# Altium schematic sheet 10-SoC CLOCK AND RESET.SchDoc
size 513 x 386 mm
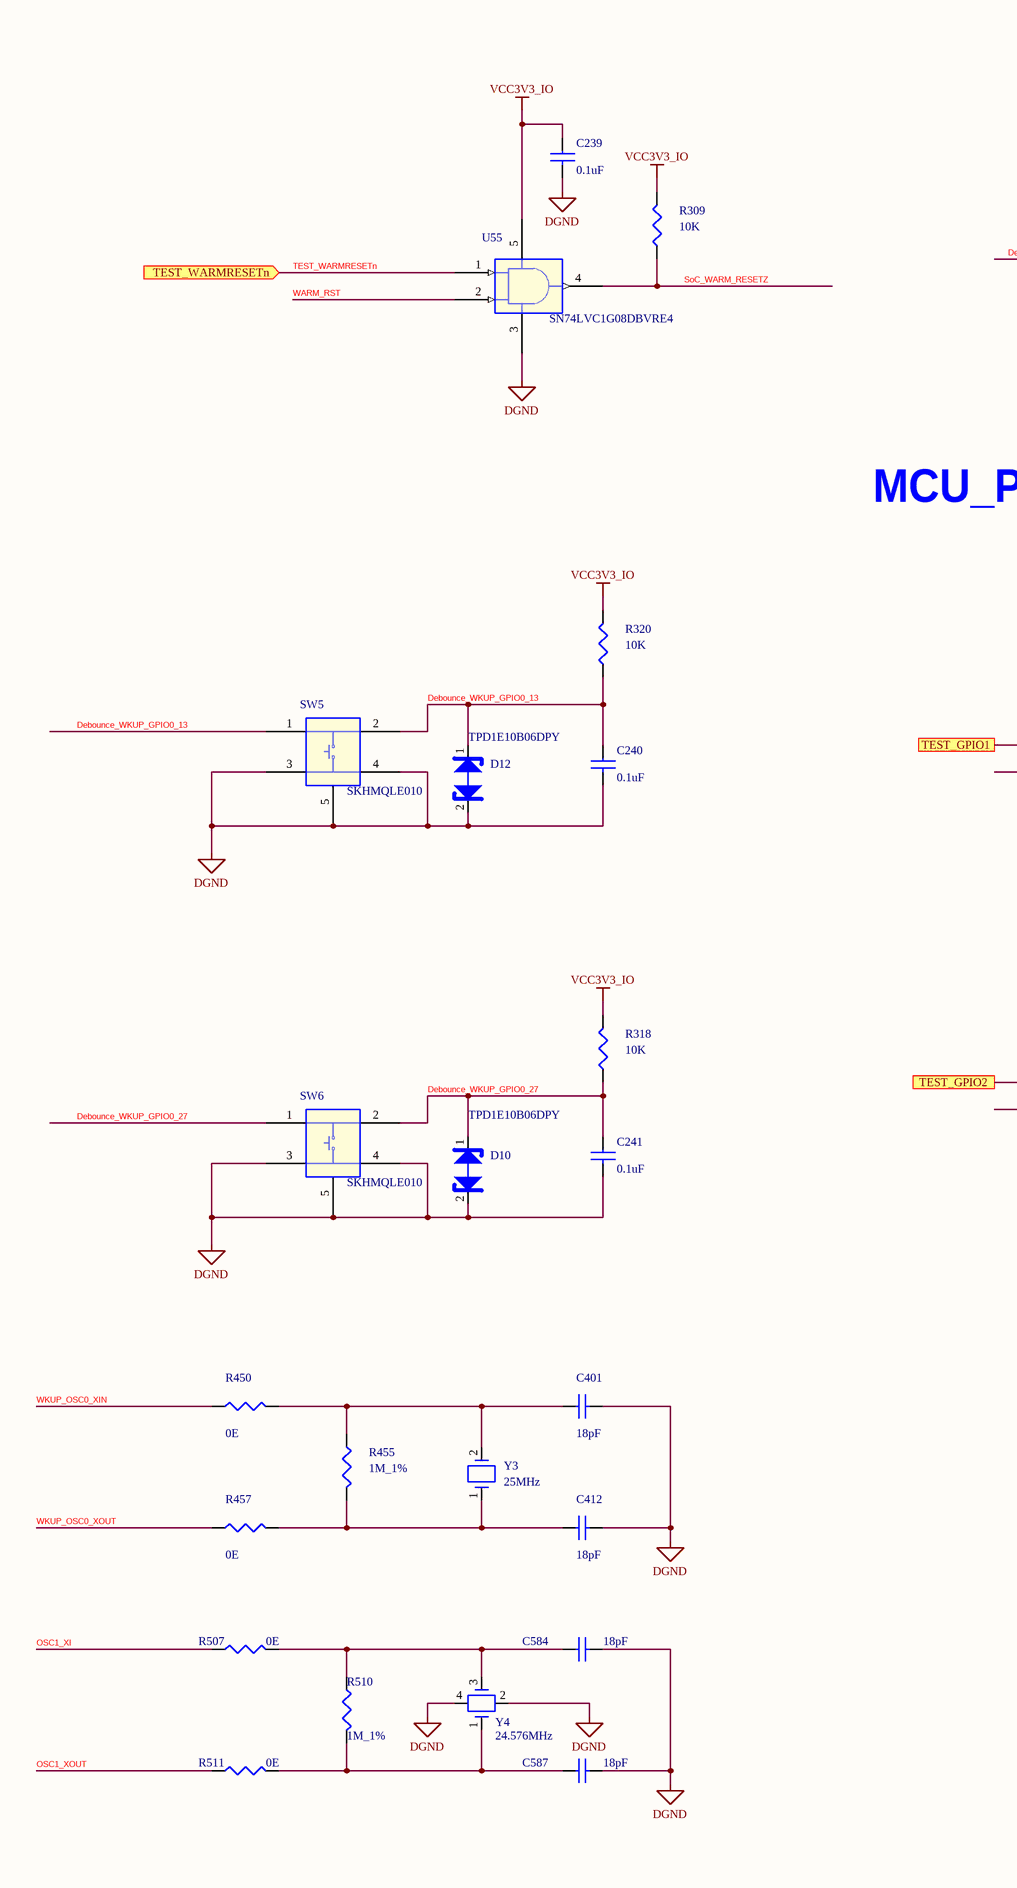
[diagram p0: 10-SoC CLOCK AND RESET.SchDoc, left]
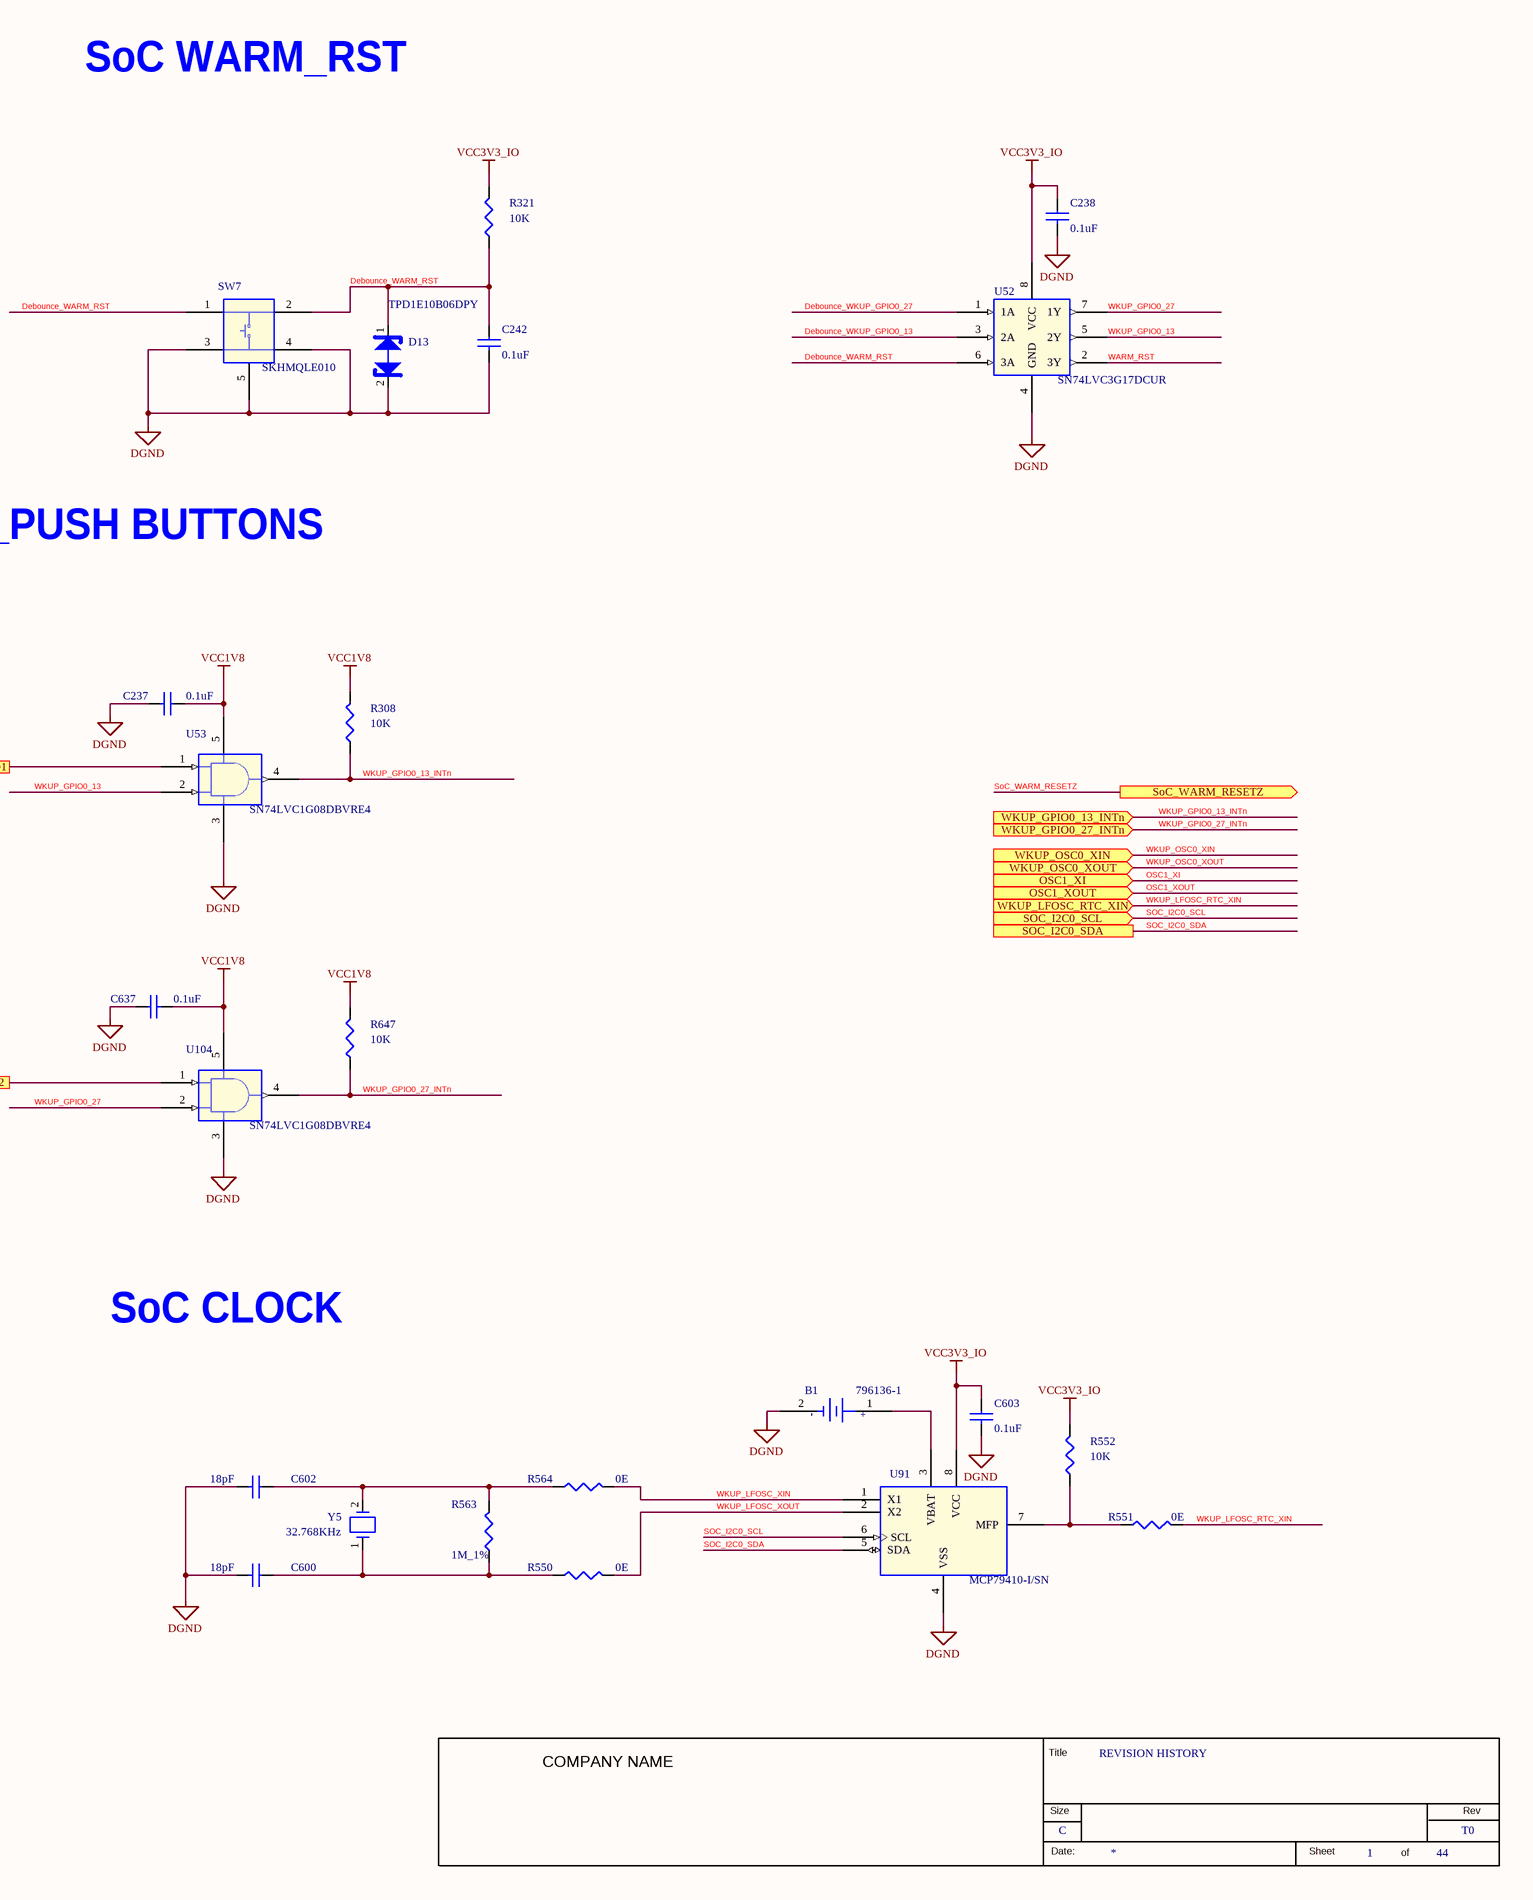
[diagram p1: 10-SoC CLOCK AND RESET.SchDoc, right]

## Parts
*  RevCode: T0  Title: REVISION HISTORY  Page Size: C  Page Number: 1  Page Count: 44  (hidden comment: TRAINING_TITLEBLK_CSIZE)  (graphical)
B1  796136-1  [BATTH2_796136_1080X750_SMD_6-9]
C237  0.1uF  [CAP0201_0-5]
C238  0.1uF  [CAP0201_0-5]
C239  0.1uF  [CAP0201_0-5]
C240  0.1uF  [CAP0201_0-5]
C241  0.1uF  [CAP0201_0-5]
C242  0.1uF  [CAP0201_0-5]
C401  18pF  [CAP0402_0-75]
C412  18pF  [CAP0402_0-75]
C584  18pF  [CAP0402_0-75]
C587  18pF  [CAP0402_0-75]
C600  18pF  [CAP0402_0-75]
C602  18pF  [CAP0402_0-75]
C603  0.1uF  [CAP0201_0-5]
C637  0.1uF  [CAP0201_0-5]
D10  TPD1E10B06DPY  [DIO_DFN0402]
D12  TPD1E10B06DPY  [DIO_DFN0402]
D13  TPD1E10B06DPY  [DIO_DFN0402]
R308  10K  [RES0402_0-5]
R309  10K  [RES0402_0-5]
R318  10K  [RES0402_0-5]
R320  10K  [RES0402_0-5]
R321  10K  [RES0402_0-5]
R450  0E  [RES0402_0-5]
R455  1M_1%  [RES0402]
R457  0E  [RES0402_0-5]
R507  0E  [RES0402_0-5]
R510  1M_1%  [RES0402]
R511  0E  [RES0402_0-5]
R550  0E  [RES0402_0-5]
R551  0E  [RES0402_0-5]
R552  10K  [RES0402_0-5]
R563  1M_1%  [RES0402]
R564  0E  [RES0402_0-5]
R647  10K  [RES0402_0-5]
SW5  SKHMQLE010  [SW4_SKHMQLE010_240X260_SMD_3-1]
SW6  SKHMQLE010  [SW4_SKHMQLE010_240X260_SMD_3-1]
SW7  SKHMQLE010  [SW4_SKHMQLE010_240X260_SMD_3-1]
U52  SN74LVC3G17DCUR  [VSSOP8_19-68_85X95_0-9]
U53  SN74LVC1G08DBVRE4  [SOT23-5]
U55  SN74LVC1G08DBVRE4  [SOT23-5]
U91  MCP79410-I/SN  [SOIC8_1-8]
U104  SN74LVC1G08DBVRE4  [SOT23-5]
Y3  25MHz  [XTAL_ABM3_210X130_SMD]
Y4  24.576MHz  [XTAL4_TXC_130X100_SMD_0-8]
Y5  32.768KHz  [XTAL_ABS07_130X60_SMD_0-9]

## Ports
OSC1_XI (in), OSC1_XOUT (in), SOC_I2C0_SCL (in), SOC_I2C0_SDA, SoC_WARM_RESETZ (out), TEST_GPIO1, TEST_GPIO2, TEST_WARMRESETn (in), WKUP_GPIO0_13_INTn (in), WKUP_GPIO0_27_INTn (in), WKUP_LFOSC_RTC_XIN (in), WKUP_OSC0_XIN (in), WKUP_OSC0_XOUT (in)

## Nets
DGND: B1.2(-) C237.2 C238.2 C239.2 C240.2 C241.2 C242.2 C401.2 C412.2 C584.2 C587.2 C600.2 C602.2 C603.2 C637.1 D10.2(A) D12.2(A) D13.2(A) SW5.3 SW5.4 SW5.5(GND) SW6.3 SW6.4 SW6.5(GND) SW7.3 SW7.4 SW7.5(GND) U52.4(GND) U53.3(GND) U55.3(GND) U91.4(VSS) U104.3(GND) Y4.2 Y4.4
VCC1V8: C237.1 C637.2 R308.2 R647.2 U53.5(VCC) U104.5(VCC)
VCC3V3_IO: C238.1 C239.1 C603.1 R309.2 R318.2 R320.2 R321.2 R552.2 U52.8(VCC) U55.5(VCC) U91.8(VCC)
Debounce_WARM_RST: C242.1 D13.1(K) R321.1 SW7.1 SW7.2 U52.6(3A)
Debounce_WKUP_GPIO0_13: C240.1 D12.1(K) R320.1 SW5.1 SW5.2 U52.3(2A)
Debounce_WKUP_GPIO0_27: C241.1 D10.1(K) R318.1 SW6.1 SW6.2 U52.1(1A)
OSC1_XI: R507.1 ; port OSC1_XI
OSC1_XOUT: R511.1 ; port OSC1_XOUT
SOC_I2C0_SCL: U91.6(SCL) ; port SOC_I2C0_SCL
SOC_I2C0_SDA: U91.5(SDA) ; port SOC_I2C0_SDA
SoC_WARM_RESETZ: R309.1 U55.4(Y) ; port SoC_WARM_RESETZ
TEST_GPIO1: U53.1(A) ; port TEST_GPIO1
TEST_GPIO2: U104.1(A) ; port TEST_GPIO2
TEST_WARMRESETn: U55.1(A) ; port TEST_WARMRESETn
WARM_RST: U52.2(3Y) U55.2(B)
WKUP_GPIO0_13: U52.5(2Y) U53.2(B)
WKUP_GPIO0_13_INTn: R308.1 U53.4(Y) ; port WKUP_GPIO0_13_INTn
WKUP_GPIO0_27: U52.7(1Y) U104.2(B)
WKUP_GPIO0_27_INTn: R647.1 U104.4(Y) ; port WKUP_GPIO0_27_INTn
WKUP_LFOSC_RTC_XIN: R551.2 ; port WKUP_LFOSC_RTC_XIN
WKUP_LFOSC_XIN: R564.1 U91.1(X1)
WKUP_LFOSC_XOUT: R550.1 U91.2(X2)
WKUP_OSC0_XIN: R450.1 ; port WKUP_OSC0_XIN
WKUP_OSC0_XOUT: R457.1 ; port WKUP_OSC0_XOUT
NetB1_1: B1.1(+) U91.3(VBAT)
NetC401_1: C401.1 R450.2 R455.1 Y3.2
NetC412_1: C412.1 R455.2 R457.2 Y3.1
NetC584_1: C584.1 R507.2 R510.1 Y4.3
NetC587_1: C587.1 R510.2 R511.2 Y4.1
NetC600_1: C600.1 R550.2 R563.2 Y5.1
NetC602_1: C602.1 R563.1 R564.2 Y5.2
NetR551_1: R551.1 R552.1 U91.7(MFP)

## Notes on the sheet
- SoC WARM_RST
- MCU_PUSH BUTTONS
- SoC CLOCK
- (in symbol TRAINING_TITLEBLK_CSIZE) Title; COMPANY NAME; Size; Rev; Date:; Sheet; of

## Library data of the parts
* = TRAINING_TITLEBLK_CSIZE: Issue: 1.0; Page Create Date: Jan  8, 2022; Page Modify Date: *
B1 = BATTERY: BATTERY HOLDER COIN CELL TOP LOAD SMD; Mfr_name: AMP INCORPORATED; Mistral Part No: 130011020020-R; Wattage: NA; Project: OMAPL1_PEC20; Library Ref: BATTERY; Chkd/date: MANIRAJA/161017; Crtd /date: BAVISH/090211; Datasheet: Y:\MIS_DATABASE\DATASHEETS\MISC\BATTERY\796136-1.PDF; Temperature: NA; Weight: NA; Height: 6.85MM; Distributor_part_number: A99327CT-ND; Distributor_name: DIGIKEY; Package: SMD; Voltage: NA; Tolerance: NA; Part_type: BATTERY HOLDER; Mfr_part_number: 796136-1; MECHANICAL 3D STEP FILE: BATTH2_796136_1080X750_SMD_6-9; PCB Footprint: BATTH2_796136_1080X750_SMD_6-9
C237-C239 C242 = CAP_Dup5: CAP CERAMIC 0.1uF 16V 10% X5R 0201; Part_type: CAPACITORS\CERAMIC; Mfr_part_number: GRM033R61C104KE84J; Mfr_name: MURATA; Mistral Part No: 120009030072-R; Custom_Duty: 15%; Customs_HS_Code: 85322990; Wattage: NA; Project: TI_MAXIE_CPB; Library Ref: CAP; MECHANICAL 3D STEP FILE: CAP0201_0-5; Chkd/date: MANIRAJA/120218; Crtd /date: MANIRAJA/120218; Datasheet: Y:\MIS_DATABASE\DATASHEETS\CAPACITORS\GRM033R61C104KE84.PDF; Temperature: -55°C+85°C; Weight: 0.33mg; Height: 0.33MM; Distributor_part_number: 490-16742-1-ND; Distributor_name: DIGIKEY; Package: 0201; Voltage: 16V; Tolerance: 10%; PCB Footprint: CAP0201_0-5
C240 C241 C603 C637 = CAP_Dup5: CAP CERAMIC 0.1uF 16V 10% X5R 0201; Mistral Part No: 120009030072-R; Mfr_name: MURATA; Mfr_part_number: GRM033R61C104KE84J; Part_type: CAPACITORS\CERAMIC; Project: TI_MAXIE_CPB; Wattage: NA; Customs_HS_Code: 85322990; Custom_Duty: 15%; Library Ref: CAP; Tolerance: 10%; Voltage: 16V; Package: 0201; Distributor_name: DIGIKEY; Distributor_part_number: 490-16742-1-ND; Height: 0.33MM; Weight: 0.33mg; Temperature: -55°C+85°C; Datasheet: Y:\MIS_DATABASE\DATASHEETS\CAPACITORS\GRM033R61C104KE84.PDF; Crtd /date: MANIRAJA/120218; Chkd/date: MANIRAJA/120218; MECHANICAL 3D STEP FILE: CAP0201_0-5; PCB Footprint: CAP0201_0-5
C401 C412 C584 C587 C602 = CAP_Dup5: CAP CERAMIC 18pF 50V 5% C0G(NP0) 0402; Part_type: CAPACITORS\CERAMIC; Mfr_part_number: GRM1555C1H180JA01D; Mfr_name: MURATA; Mistral Part No: 120014050002-R; Custom_Duty: 15%; Customs_HS_Code: 85322990; Wattage: NA; Project: HUMANWARE_PHOENIX; Footprint Path: Y:\MIS_DATABASE\Library\ALTIUM_TOOL\PCB_FOOTPRINTS\Altium_Footprint_Lib.PcbLib; Library Path: Y:\MIS_DATABASE\Library\ALTIUM_TOOL\SCHEMATICS_PARTS\MS_DISCRETE_Library.schlib; MECHANICAL 3D STEP FILE: CAP0402_0-75; PCB Footprint: CAP0402_0-75; Footprint Ref: CAP0402_0-75; Library Ref: CAP; Chkd/date: VASANTHA/150514; Crtd /date: BALACHANDAR/150514; Datasheet: Y:\MIS_DATABASE\DATASHEETS\CAPACITORS\GRM188SERIES.PDF; Temperature: -55°C+125°C; Weight: 6mg; Height: 0.55MM; Distributor_part_number: 490-5858-1-ND; Distributor_name: DIGIKEY; Package: 0402; Voltage: 50V; Tolerance: 5%
C600 = CAP_Dup5: CAP CERAMIC 18pF 50V 5% C0G(NP0) 0402; Mistral Part No: 120014050002-R; Mfr_name: MURATA; Mfr_part_number: GRM1555C1H180JA01D; Part_type: CAPACITORS\CERAMIC; Project: HUMANWARE_PHOENIX; Wattage: NA; Customs_HS_Code: 85322990; Custom_Duty: 15%; Footprint Path: Y:\MIS_DATABASE\Library\ALTIUM_TOOL\PCB_FOOTPRINTS\Altium_Footprint_Lib.PcbLib; Library Path: Y:\MIS_DATABASE\Library\ALTIUM_TOOL\SCHEMATICS_PARTS\MS_DISCRETE_Library.schlib; MECHANICAL 3D STEP FILE: CAP0402_0-75; PCB Footprint: CAP0402_0-75; Footprint Ref: CAP0402_0-75; Library Ref: CAP; Tolerance: 5%; Voltage: 50V; Package: 0402; Distributor_name: DIGIKEY; Distributor_part_number: 490-5858-1-ND; Height: 0.55MM; Weight: 6mg; Temperature: -55°C+125°C; Datasheet: Y:\MIS_DATABASE\DATASHEETS\CAPACITORS\GRM188SERIES.PDF; Crtd /date: BALACHANDAR/150514; Chkd/date: VASANTHA/150514
D10 D12 = DIODE_PESD: DIODE 1CH ESD PROTECTION SMD(0402); Mistral Part No: 130014110022-R; Mfr_name: TEXAS INSTRUMENTS; Part_type: DIODE\MISC; Project: GALILEO_EVM; Tolerance: NA; Customs_HS_Code: 85423100; Custom_Duty: 15%; Library Ref: DIODE_PESD; Mfr_part_number: TPD1E10B06DPY; Voltage: NA; Wattage: NA; Package: SMD; Distributor_name: DIGIKEY; Distributor_part_number: 296-30406-1-ND; Height: 0.45MM; Weight: NA; Temperature: -40°C+125°C; Datasheet: Y:\MIS_DATABASE\DATASHEETS\ICS\INTERFACE\TPD1E10B06.PDF; Crtd /date: VASANTHA/181114; Chkd/date: USMAN/021214; PCB Footprint: DIO_DFN0402
D13 = DIODE_PESD: DIODE 1CH ESD PROTECTION SMD(0402); Part_type: DIODE\MISC; Mfr_name: TEXAS INSTRUMENTS; Mistral Part No: 130014110022-R; Custom_Duty: 15%; Customs_HS_Code: 85423100; Wattage: NA; Project: GALILEO_EVM; Library Ref: DIODE_PESD; Chkd/date: USMAN/021214; Crtd /date: VASANTHA/181114; Datasheet: Y:\MIS_DATABASE\DATASHEETS\ICS\INTERFACE\TPD1E10B06.PDF; Temperature: -40°C+125°C; Weight: NA; Height: 0.45MM; Distributor_part_number: 296-30406-1-ND; Distributor_name: DIGIKEY; Package: SMD; Voltage: NA; Tolerance: NA; Mfr_part_number: TPD1E10B06DPY; PCB Footprint: DIO_DFN0402
R308 R647 = RESISTOR_Dup5: RES 10K 1/16W 5% 0402; Mistral Part No: 110009030208-R; Mfr_name: YAGEO AMERICA; Mfr_part_number: RC0402JR-0710KL; Part_type: RESISTORS\FIXED; Project: HSE; Voltage: NA; Customs_HS_Code: 85332119; Custom_Duty: 15%; Footprint Path: Y:\MIS_DATABASE\Library\ALTIUM_TOOL\PCB_FOOTPRINTS\Altium_Footprint_Lib.PcbLib; Library Path: Y:\MIS_DATABASE\Library\ALTIUM_TOOL\SCHEMATICS_PARTS\MS_DISCRETE_Library.schlib; Footprint Ref: RES0402_0-5; Library Ref: RESISTOR; Tolerance: 5%; Wattage: 1/16W; Package: 0402; Distributor_name: DIGIKEY; Distributor_part_number: 311-10KJRCT-ND; Height: 0.40MM; Weight: 0.65mg; Temperature: -55°C+155°C; Datasheet: Y:\MIS_DATABASE\DATASHEETS\RESISTORS\YAGEO-RC0402.PDF; Crtd /date: MAZHAR/230805; Chkd/date: VASANTHA/061216; RoHS: Pb-Free; MECHANICAL 3D STEP FILE: RES0402_0-5; PCB Footprint: RES0402_0-5
R309 R318 R320 R321 R552 = RESISTOR_Dup5: RES 10K 1/16W 5% 0402; Part_type: RESISTORS\FIXED; Mfr_part_number: RC0402JR-0710KL; Mfr_name: YAGEO AMERICA; Mistral Part No: 110009030208-R; Custom_Duty: 15%; Customs_HS_Code: 85332119; Voltage: NA; Project: HSE; Footprint Path: Y:\MIS_DATABASE\Library\ALTIUM_TOOL\PCB_FOOTPRINTS\Altium_Footprint_Lib.PcbLib; Library Path: Y:\MIS_DATABASE\Library\ALTIUM_TOOL\SCHEMATICS_PARTS\MS_DISCRETE_Library.schlib; Footprint Ref: RES0402_0-5; Library Ref: RESISTOR; MECHANICAL 3D STEP FILE: RES0402_0-5; RoHS: Pb-Free; Chkd/date: VASANTHA/061216; Crtd /date: MAZHAR/230805; Datasheet: Y:\MIS_DATABASE\DATASHEETS\RESISTORS\YAGEO-RC0402.PDF; Temperature: -55°C+155°C; Weight: 0.65mg; Height: 0.40MM; Distributor_part_number: 311-10KJRCT-ND; Distributor_name: DIGIKEY; Package: 0402; Wattage: 1/16W; Tolerance: 5%; PCB Footprint: RES0402_0-5
R450 R457 R507 R511 R564 = RESISTOR_Dup4: RES 0E 1/16W 0402; Part_type: RESISTORS\FIXED; Mfr_part_number: CRCW04020000Z0ED; Mfr_name: VISHAY; Mistral Part No: 110010080019-P; Custom_Duty: 15%; Customs_HS_Code: 85332119; Voltage: NA; Project: PB_BUGBASE; Footprint Path: Y:\MIS_DATABASE\Library\ALTIUM_TOOL\PCB_FOOTPRINTS\Altium_Footprint_Lib.PcbLib; Library Path: Y:\MIS_DATABASE\Library\ALTIUM_TOOL\SCHEMATICS_PARTS\MS_DISCRETE_Library.schlib; Footprint Ref: RES0402_0-5; Library Ref: RESISTOR; RoHS: Pb-Free; Chkd/date: VASANTHA/201216; Crtd /date: MUDDU/190810; Datasheet: Y:\MIS_DATABASE\DATASHEETS\RESISTORS\CRCW0603.PDF; Temperature: -55°C+155°C; Weight: 0.65g/1000pcs; Height: 0.40MM; Distributor_part_number: 541-0.0JCT-ND; Distributor_name: DIGIKEY; Package: 0402; Wattage: 1/16W; Tolerance: NA; MECHANICAL 3D STEP FILE: RES0402_0-5; PCB Footprint: RES0402_0-5
R455 = RESISTOR_Dup5: RES 1M 1/16W 1% 0402; Part_type: RESISTORS\FIXED; Mfr_part_number: RMCF0402FT1M00; Mfr_name: STACKPOLE ELECTRONICS; Mistral Part No: 110014060045-R; Custom_Duty: 15%; Customs_HS_Code: 85332119; Voltage: NA; Project: AEGIS_POM; NI_MARK: DNI; Footprint Path: Y:\MIS_DATABASE\Library\ALTIUM_TOOL\PCB_FOOTPRINTS\Altium_Footprint_Lib.PcbLib; Library Path: Y:\MIS_DATABASE\Library\ALTIUM_TOOL\SCHEMATICS_PARTS\MS_DISCRETE_Library.schlib; Footprint Ref: RES0402; Library Ref: RESISTOR; Chkd/date: VASANTHA/200614; Crtd /date: NAVEED/170614; Datasheet: Y:\MIS_DATABASE\DATASHEETS\RESISTORS\RMCF-SERIES1.PDF; Temperature: -55°C+155°C; Weight: 0.57mg; Height: 0.40MM; Distributor_part_number: RMCF0402FT1M00CT-ND; Distributor_name: DIGIKEY; Package: 0402; Wattage: 1/16W; Tolerance: 1%; PCB Footprint: RES0402
R510 R563 = RESISTOR_Dup5: RES 1M 1/16W 1% 0402; Mistral Part No: 110014060045-R; Mfr_name: STACKPOLE ELECTRONICS; Mfr_part_number: RMCF0402FT1M00; Part_type: RESISTORS\FIXED; Project: AEGIS_POM; Voltage: NA; Customs_HS_Code: 85332119; Custom_Duty: 15%; NI_MARK: DNI; Footprint Path: Y:\MIS_DATABASE\Library\ALTIUM_TOOL\PCB_FOOTPRINTS\Altium_Footprint_Lib.PcbLib; Library Path: Y:\MIS_DATABASE\Library\ALTIUM_TOOL\SCHEMATICS_PARTS\MS_DISCRETE_Library.schlib; Footprint Ref: RES0402; Library Ref: RESISTOR; Tolerance: 1%; Wattage: 1/16W; Package: 0402; Distributor_name: DIGIKEY; Distributor_part_number: RMCF0402FT1M00CT-ND; Height: 0.40MM; Weight: 0.57mg; Temperature: -55°C+155°C; Datasheet: Y:\MIS_DATABASE\DATASHEETS\RESISTORS\RMCF-SERIES1.PDF; Crtd /date: NAVEED/170614; Chkd/date: VASANTHA/200614; PCB Footprint: RES0402
R550 R551 = RESISTOR_Dup4: RES 0E 1/16W 0402; Mistral Part No: 110010080019-P; Mfr_name: VISHAY; Mfr_part_number: CRCW04020000Z0ED; Part_type: RESISTORS\FIXED; Project: PB_BUGBASE; Tolerance: NA; Customs_HS_Code: 85332119; Custom_Duty: 15%; Footprint Path: Y:\MIS_DATABASE\Library\ALTIUM_TOOL\PCB_FOOTPRINTS\Altium_Footprint_Lib.PcbLib; Library Path: Y:\MIS_DATABASE\Library\ALTIUM_TOOL\SCHEMATICS_PARTS\MS_DISCRETE_Library.schlib; Footprint Ref: RES0402_0-5; Library Ref: RESISTOR; PCB Footprint: RES0402_0-5; MECHANICAL 3D STEP FILE: RES0402_0-5; Voltage: NA; Wattage: 1/16W; Package: 0402; Distributor_name: DIGIKEY; Distributor_part_number: 541-0.0JCT-ND; Height: 0.40MM; Weight: 0.65g/1000pcs; Temperature: -55°C+155°C; Datasheet: Y:\MIS_DATABASE\DATASHEETS\RESISTORS\CRCW0603.PDF; Crtd /date: MUDDU/190810; Chkd/date: VASANTHA/201216; RoHS: Pb-Free
SW5 SW7 = SW4_SKHUPLE010: SWITCH TACTILE SPST ST SMD; Part_type: ELECTRO-MECHANICAL\SWITCH; Mfr_name: ALPS; Mistral Part No: 130017100007-R; Custom_Duty: 24%; Customs_HS_Code: 85369090; Wattage: NA; Project: TI_MAXIE_CPB; Library Ref: SW4_SKHUPLE010; MECHANICAL 3D STEP FILE: SW4_SKHMQLE010_240X260_SMD_3-1; Chkd/date: MANIRAJA/051017; Crtd /date: MANIRAJA/051017; Datasheet: Y:\MIS_DATABASE\DATASHEETS\MISC\SWITCHES\SKHMQLE010.PDF; Temperature: -30°C+85°C; Weight: NA; Height: 3.10MM; Distributor_part_number: 688-SKHMQLE010; Distributor_name: MOUSER; Package: SMD; Voltage: NA; Tolerance: NA; Mfr_part_number: SKHMQLE010; PCB Footprint: SW4_SKHMQLE010_240X260_SMD_3-1
SW6 = SW4_SKHUPLE010: SWITCH TACTILE SPST ST SMD; Mistral Part No: 130017100007-R; Mfr_name: ALPS; Part_type: ELECTRO-MECHANICAL\SWITCH; Project: TI_MAXIE_CPB; Tolerance: NA; Customs_HS_Code: 85369090; Custom_Duty: 24%; Library Ref: SW4_SKHUPLE010; Mfr_part_number: SKHMQLE010; Voltage: NA; Wattage: NA; Package: SMD; Distributor_name: MOUSER; Distributor_part_number: 688-SKHMQLE010; Height: 3.10MM; Weight: NA; Temperature: -30°C+85°C; Datasheet: Y:\MIS_DATABASE\DATASHEETS\MISC\SWITCHES\SKHMQLE010.PDF; Crtd /date: MANIRAJA/051017; Chkd/date: MANIRAJA/051017; MECHANICAL 3D STEP FILE: SW4_SKHMQLE010_240X260_SMD_3-1; PCB Footprint: SW4_SKHMQLE010_240X260_SMD_3-1
U52 = SN74LVC3G17DCUR_VSSOP8: IC TRIPLE SCHMITT-TRIGGER BUFFER VSSOP8; Mistral Part No: 141017090019-R; Mfr_name: TEXAS INSTRUMENTS; Part_type: ICS\DIGITAL\COMBINATIONAL; Project: TI_MAXIE_CPB; Tolerance: NA; Customs_HS_Code: 85423100; Custom_Duty: 15%; Library Ref: SN74LVC3G17DCUR_VSSOP8; Mfr_part_number: SN74LVC3G17DCUR; Voltage: NA; Wattage: NA; Package: VSSOP8; Distributor_name: DIGIKEY; Distributor_part_number: 296-18818-1-ND; Height: 0.90MM; Weight: 9.6mg; Temperature: -40°C+125°C; Datasheet: Y:\MIS_DATABASE\DATASHEETS\ICS\DIGITAL\COMBINATIONAL\SN74LVC3G17.PDF; Crtd /date: MANIRAJA/280917; Chkd/date: MANIRAJA/280917; MECHANICAL 3D STEP FILE: VSSOP8_19-68_85X95_0-9; PCB Footprint: VSSOP8_19-68_85X95_0-9
U53 U55 U104 = SN74LVC1G08DBVRE4_SOT23-5: IC SINGLE 2-INPUT POSITIVE AND GATE SOT23-5; Part_type: ICS\DIGITAL\GATES; Mfr_name: TEXAS INSTRUMENTS; Mistral Part No: 141009060026-R; Custom_Duty: 15%; Customs_HS_Code: 85423100; Project: KHAN_MAIN; Library Ref: SN74LVC1G08DBVRE4_SOT23-5; RoHS: Sb/ Br FREE; Chkd/date: SUHAS/221010; Crtd /date: USMAN/151008; Datasheet: Y:\MIS_DATABASE\DATASHEETS\ICS\DIGITAL\GATES\SN74LVC1G08.PDF; Temperature: -40°C+85°C; Height: 1.45MM; Distributor_part_number: SN74LVC1G08DBVRE4-ND; Distributor_name: DIGIKEY; Package: SOT23-5; Mfr_part_number: SN74LVC1G08DBVRE4; PCB Footprint: SOT23-5
U91 = MCP79410_SOIC8: IC BATTERY-BACKED I2C RTCC WITH SRAM,EEPROM SOIC8; Part_type: ICS\POWER\BATTERY MANGEMENT; Mfr_name: MICROCHIP; Mistral Part No: 142017060006-R; Custom_Duty: 15%; Customs_HS_Code: 85423100; Wattage: NA; Project: TI_SVB_CONTROLLER CARD; Library Ref: MCP79410_SOIC8; MECHANICAL 3D STEP FILE: SOIC8_1-8; Chkd/date: MANIRAJA/190617; Crtd /date: MANIRAJA/190617; Datasheet: Y:\MIS_DATABASE\DATASHEETS\ICS\POWER\MCP7941XX.PDF; Temperature: -40°C+85°C; Weight: 540mg; Height: 1.75MM; Distributor_part_number: MCP79410-I/SN-ND; Distributor_name: DIGIKEY; Package: SOIC8; Voltage: NA; Tolerance: NA; Mfr_part_number: MCP79410-I/SN; PCB Footprint: SOIC8_1-8
Y3 = CRY: CRY 25MHz SMD; Mistral Part No: 130011100003-R; Mfr_name: CTS; Mfr_part_number: 445I23D25M00000; Part_type: CRYSTAL; Project: VP-4000-PROCESSOR; Tolerance: NA; Customs_HS_Code: 85439000; Custom_Duty: 24%; Library Ref: CRY; Voltage: NA; Wattage: NA; Package: SMD; Distributor_name: DIGIKEY; Distributor_part_number: 535-10645-1-ND; Height: 1.50MM; Weight: NA; Temperature: -40°C+85°C; Datasheet: Y:\MIS_DATABASE\DATASHEETS\MISC\CRY_OSC\ABM3.PDF; Crtd /date: CHAITHANYA/041011; Chkd/date: BAVISH/041011; PCB Footprint: XTAL_ABM3_210X130_SMD
Y4 = CRY4_13: CRY 24.576MHz 18pF SMD; Mistral Part No: 130018010021-R; Mfr_name: TXC CORPORATION; Mfr_part_number: 7M-24.576MAAJ-T; Part_type: CRYSTAL; Project: TI_MAXIE_CPB; Tolerance: NA; Customs_HS_Code: 85439000; Custom_Duty: 24%; Library Ref: CRY4_13; PCB Footprint: XTAL4_TXC_130X100_SMD_0-8; Voltage: NA; Wattage: NA; Package: SMD; Distributor_name: DIGIKEY; Distributor_part_number: 887-2373-1-ND; Height: 0.80MM; Weight: 16mg; Temperature: -20°C+70°C; Datasheet: Y:\MIS_DATABASE\DATASHEETS\MISC\CRY_OSC\7M-SER.PDF; Crtd /date: MANIRAJA/240118; Chkd/date: MANIRAJA/240118; MECHANICAL 3D STEP FILE: XTAL4_TXC_130X100_SMD_0-8
Y5 = CRY: CRY 32.768KHz 12.5pF SMD; Mistral Part No: 130009030082-R; Mfr_name: ABRACON; Mfr_part_number: ABS07-32.768KHZ-T; Part_type: CRYSTAL; Project: SMART VIEW_IP CAMERA; Tolerance: NA; Customs_HS_Code: 85439000; Custom_Duty: 24%; Library Ref: CRY; Voltage: NA; Wattage: NA; Package: SMD; Distributor_name: DIGIKEY; Distributor_part_number: 535-9542-1-ND; Height: 0.90MM; Weight: 16mg; Temperature: -40°C+85°C; Datasheet: Y:\MIS_DATABASE\DATASHEETS\MISC\CRY_OSC\ABS07.PDF; Crtd /date: MAZHAR/250907; Chkd/date: VASANTHA/050117; MECHANICAL 3D STEP FILE: XTAL_ABS07_130X60_SMD_0-9; PCB Footprint: XTAL_ABS07_130X60_SMD_0-9